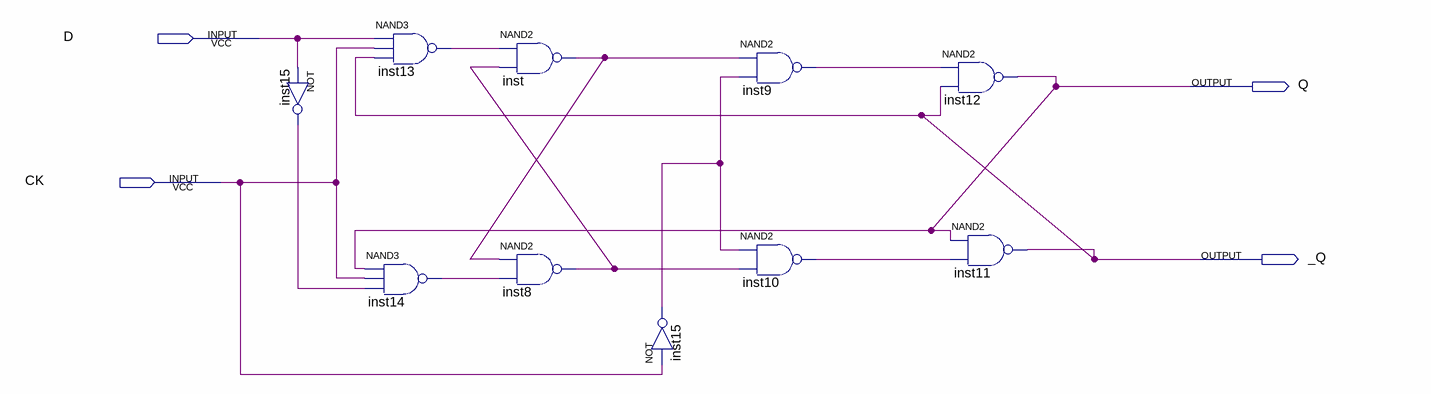
[diagram p0: schematic sheet]
// Quartus schematic ffdclkms.bdf as structural Verilog: 10 symbols, 4 pins
module ffdclkms (
  input  D,
  input  CK,
  output Q,
  output _Q
);

  wire inst8_out, inst9_out, inst10_out, inst13_out, inst14_out, inst15_out, inst15_out_2, inst_out;

  not inst15 (inst15_out, D);
  nand inst14 (inst14_out, Q, CK, inst15_out);
  nand inst13 (inst13_out, D, CK, _Q);
  nand inst (inst_out, inst13_out, inst8_out);
  nand inst8 (inst8_out, inst_out, inst14_out);
  not inst15_dup2 (inst15_out_2, CK);
  nand inst9 (inst9_out, inst_out, inst15_out_2);
  nand inst10 (inst10_out, inst15_out_2, inst8_out);
  nand inst12 (Q, inst9_out, _Q);
  nand inst11 (_Q, Q, inst10_out);
endmodule
